# EAGLE design M-S (rev 01) (EAGLE 6.5.0)

## Sheet 1 of 3
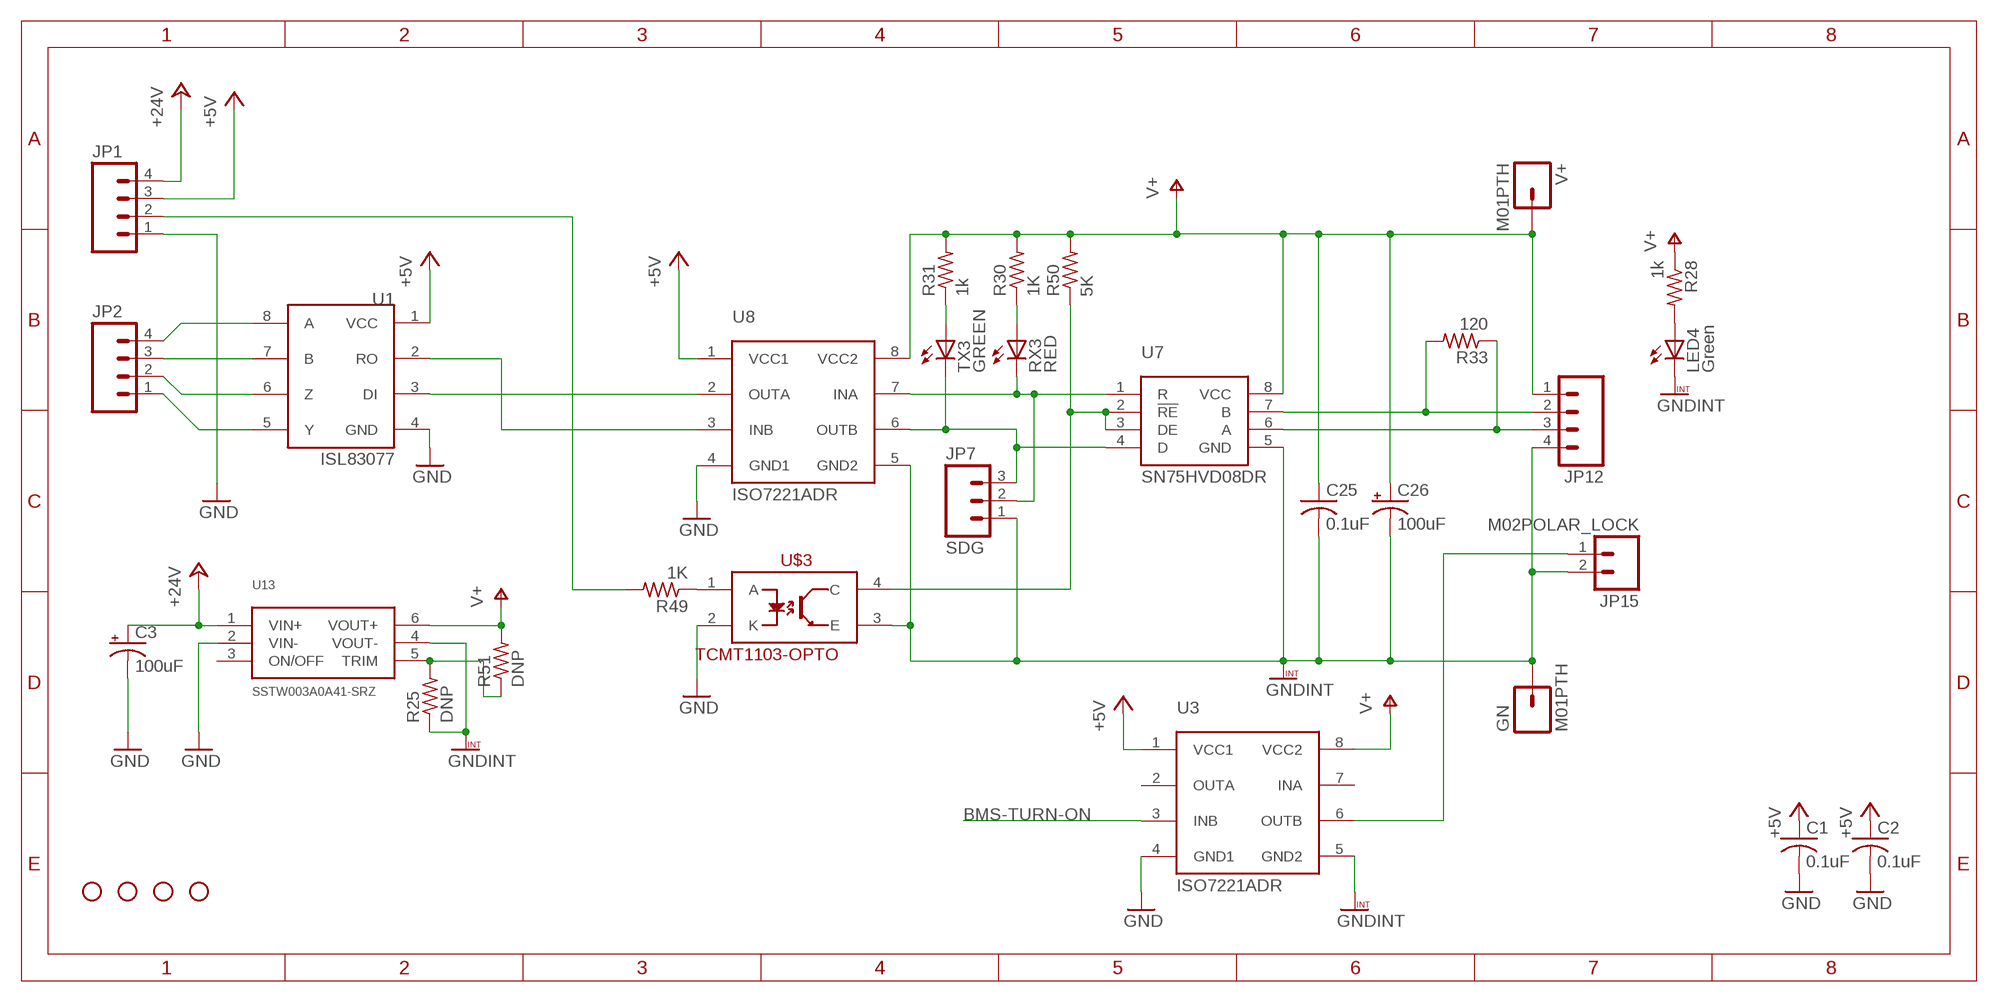
[diagram p0: schematic, sheet 1]

### Parts
C1  0.1uF  C-USC0805  [C0805]
C2  0.1uF  C-USC0805  [C0805]
C3  100uF  CPOL-USC/6032-28W  [C/6032-28W]
C25  0.1uF  C-USC0805  [C0805]
C26  100uF  CPOL-USC/6032-28W  [C/6032-28W]
GN  M01PTH  [1X01]
JP1  M04POLAR_LOCK  [MOLEX-1X4_LOCK]
JP2  M04POLAR_LOCK  [MOLEX-1X4_LOCK]
JP7  SDG  M03LOCK_LONGPADS  [1X03_LOCK_LONGPADS]
JP12  M04POLAR_LOCK  [MOLEX-1X4_LOCK]
JP15  M02POLAR_LOCK  [MOLEX-1X2_LOCK]
LED4  Green  LEDCHIPLED_0805  [CHIPLED_0805]
R25  DNP  R-US_R0805  [R0805]
R28  1k  R-US_R0805  [R0805]
R30  1K  R-US_R0805  [R0805]
R31  1k  R-US_R0805  [R0805]
R33  120  R-US_R0805  [R0805]
R49  1K  R-US_R0805  [R0805]
R50  5K  R-US_R0805  [R0805]
R51  DNP  R-US_R0805  [R0805]
RX3  RED  LEDCHIPLED_0805  [CHIPLED_0805]
STANDOFF1  STAND-OFF  [STAND-OFF]
STANDOFF2  STAND-OFF  [STAND-OFF]
STANDOFF3  STAND-OFF  [STAND-OFF]
STANDOFF4  STAND-OFF  [STAND-OFF]
TX3  GREEN  LEDCHIPLED_0805  [CHIPLED_0805]
U1  ISL83077  [SO08]
U3  ISO7221ADR  [SOIC-8]
U7  SN75HVD08DR  [SO-8]
U8  ISO7221ADR  [SOIC-8]
U13  SSTW003A0A41-SRZ  [SSTW003A0A41-SRZ]
U$3  TCMT1103-OPTO  [SSOP-4]
V+  M01PTH  [1X01]

### Nets
+5V: C1.1 C2.1 JP1.3 U1.1(VCC) U3.1(VCC1) U8.1(VCC1) ; also sheet 2
+24V: C3.+ JP1.4 U13.1(VIN+)
BMS-TURN-ON: U3.3(INB) ; also sheet 3
GND: C1.2 C2.2 C3.- JP1.1 U1.4(GND) U3.4(GND1) U8.4(GND1) U13.2(VIN-) U$3.2(K) ; also sheet 2,3
GNDINT: C25.2 C26.- GN.1 JP7.1 JP12.4 JP15.2 LED4.C R25.1 U3.5(GND2) U7.5(GND) U8.5(GND2) U13.4(VOUT-) U$3.3(E)
N$1: U1.3(DI) U8.2(OUTA)
N$2: U1.2(RO) U8.3(INB)
N$3: JP2.4 U1.8(A)
N$4: JP2.3 U1.7(B)
N$5: JP2.2 U1.6(Z)
N$6: JP2.1 U1.5(Y)
N$7: JP1.2 R49.2
N$21: JP15.1 U3.6(OUTB)
N$25: JP12.2 R33.2 U7.7(B)
N$31: JP12.3 R33.1 U7.6(A)
N$33: R25.2 R51.1 U13.5(TRIM)
N$50: LED4.A R28.2
N$56: R49.1 U$3.1(A)
N$59: R50.1 U7.2(!RE) U7.3(DE) U$3.4(C)
N$73: R30.1 RX3.A
N$74: R31.1 TX3.A
PIC1: JP7.2 RX3.C U7.1(R) U8.7(INA)
PIC2: JP7.3 TX3.C U7.4(D) U8.6(OUTB)
V+: C25.1 C26.+ JP12.1 R28.1 R30.2 R31.2 R50.2 R51.2 U3.8(VCC2) U7.8(VCC) U8.8(VCC2) U13.6(VOUT+) V+.1
Unconnected: U3.2(OUTA) U3.7(INA) U13.3(ON/OFF)

## Sheet 2 of 3
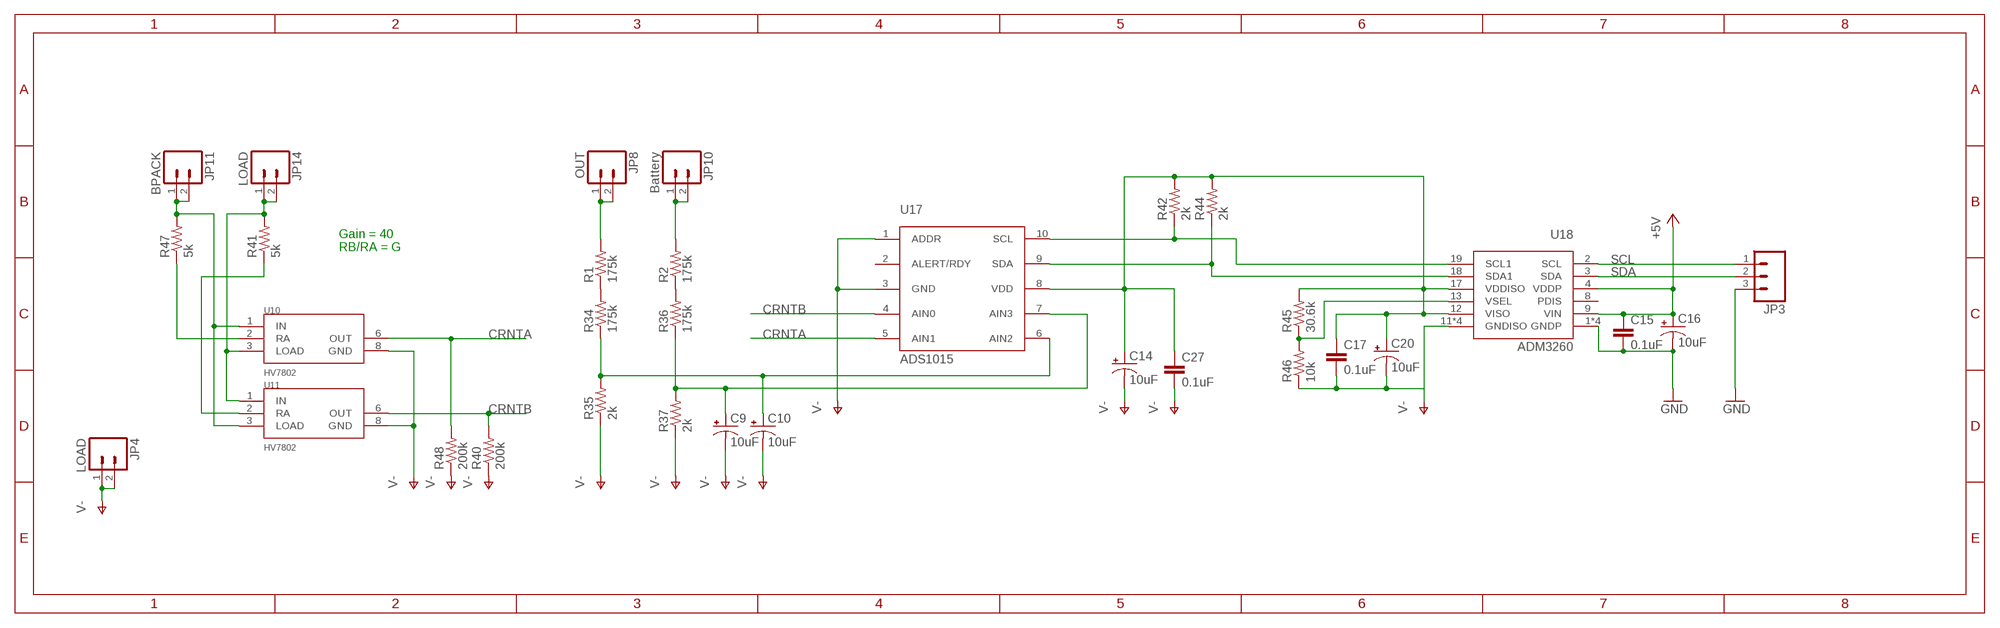
[diagram p1: schematic, sheet 2]

### Parts
C9  10uF  CAP_POL1206  [EIA3216]
C10  10uF  CAP_POL1206  [EIA3216]
C14  10uF  CAP_POL1206  [EIA3216]
C15  0.1uF  CAP0805  [0805]
C16  10uF  CAP_POL1206  [EIA3216]
C17  0.1uF  CAP0805  [0805]
C20  10uF  CAP_POL1206  [EIA3216]
C27  0.1uF  CAP0805  [0805]
JP3  M03POLAR_LOCK  [MOLEX-1X3_LOCK]
JP4  LOAD  M02POLAR_LOCK  [MOLEX-1X2_LOCK]
JP8  OUT  M02POLAR_LOCK  [MOLEX-1X2_LOCK]
JP10  Battery  M02POLAR_LOCK  [MOLEX-1X2_LOCK]
JP11  BPACK  M02POLAR_LOCK  [MOLEX-1X2_LOCK]
JP14  LOAD  M02POLAR_LOCK  [MOLEX-1X2_LOCK]
R1  175k  RESISTOR1206  [1206]
R2  175k  RESISTOR1206  [1206]
R34  175k  RESISTOR1206  [1206]
R35  2k  RESISTOR1206  [1206]
R36  175k  RESISTOR1206  [1206]
R37  2k  RESISTOR1206  [1206]
R40  200k  RESISTOR0805-RES  [0805]
R41  5k  RESISTOR0805-RES  [0805]
R42  2k  RESISTOR0805-RES  [0805]
R44  2k  RESISTOR0805-RES  [0805]
R45  30.6k  RESISTOR0805-RES  [0805]
R46  10k  RESISTOR0805-RES  [0805]
R47  5k  RESISTOR0805-RES  [0805]
R48  200k  RESISTOR0805-RES  [0805]
U10  HV7802  [MSOP-8]
U11  HV7802  [MSOP-8]
U17  ADS1015  [MSOP-10]
U18  ADM3260  [SSOP-20]

### Nets
+5V: C15.1 C16.A(+) U18.4(VDDP) U18.9(VIN) ; also sheet 1
CRNTA: R48.2 U10.6(OUT) U17.5(AIN1)
CRNTB: R40.2 U11.6(OUT) U17.4(AIN0)
GND: C15.2 C16.C(-) JP3.3 U18.1(GNDP) U18.5(GNDP) U18.7(GNDP) U18.10(GNDP) ; also sheet 1,3
N$8: R41.1 U11.2(RA)
N$9: R47.1 U10.2(RA)
N$10: R1.1 R34.2
N$11: JP14.1 JP14.2 R41.2 U10.3(LOAD) U11.1(IN)
N$12: R2.1 R36.2
N$35: JP8.1 JP8.2 R1.2
N$42: JP11.1 JP11.2 R47.2 U10.1(IN) U11.3(LOAD)
N$43: C10.A(+) R34.1 R35.2 U17.6(AIN2)
N$52: JP10.1 JP10.2 R2.2
N$53: C9.A(+) R36.1 R37.2 U17.7(AIN3)
N$57: C14.A(+) C17.1 C20.A(+) C27.1 R42.2 R44.2 R45.2 U17.8(VDD) U18.12(VISO) U18.17(VDDISO)
N$60: R42.1 U17.10(SCL) U18.19(SCL1)
N$67: R44.1 U17.9(SDA) U18.18(SDA1)
N$68: R45.1 R46.2 U18.13(VSEL)
SCL: JP3.1 U18.2(SCL)
SDA: JP3.2 U18.3(SDA)
V-: C9.C(-) C10.C(-) C14.C(-) C17.2 C20.C(-) C27.2 JP4.1 JP4.2 R35.1 R37.1 R40.1 R46.1 R48.1 U10.8(GND) U11.8(GND) U17.1(ADDR) U17.3(GND) U18.11(GNDISO) U18.14(GNDISO) U18.16(GNDISO) U18.20(GNDISO) ; also sheet 3
Unconnected: U17.2(ALERT/RDY) U18.8(PDIS)

### Notes on the sheet
- Gain = 40
  RB/RA = G

## Sheet 3 of 3
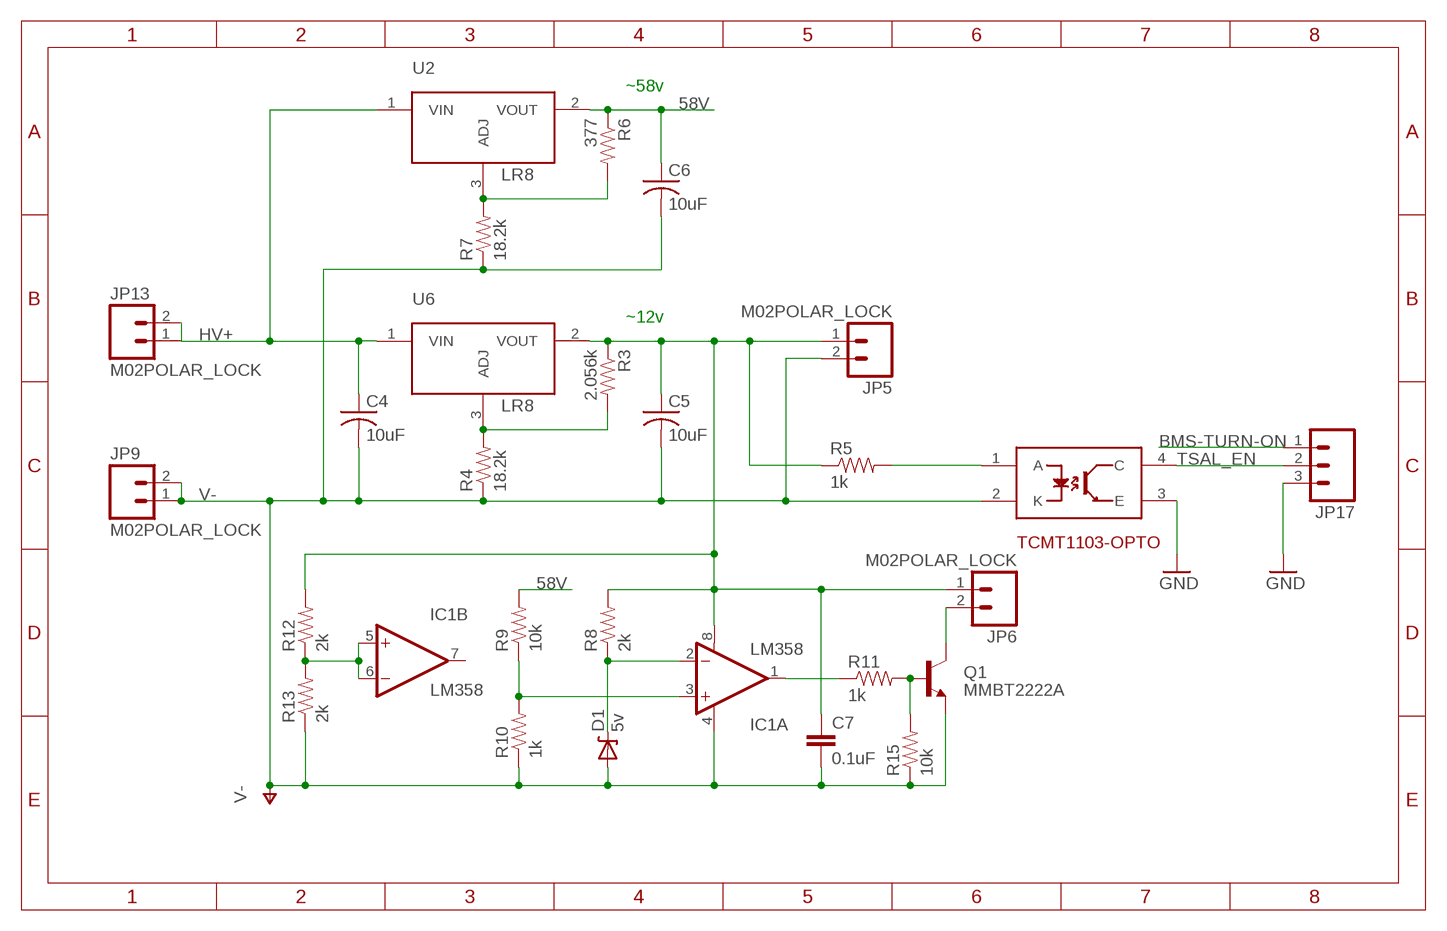
[diagram p2: schematic, sheet 3]

### Parts
C4  10uF  C-US050-030X075  [C050-030X075]
C5  10uF  C-USC0805  [C0805]
C6  10uF  C-USC0805  [C0805]
C7  0.1uF  CAP0805  [0805]
D1  5v  DIODE-ZENER-BZT52  [SOD-323@1]
IC1  LM358  OPAMP-DUALU  [SO08]
JP5  M02POLAR_LOCK  [MOLEX-1X2_LOCK]
JP6  M02POLAR_LOCK  [MOLEX-1X2_LOCK]
JP9  M02POLAR_LOCK  [MOLEX-1X2_LOCK]
JP13  M02POLAR_LOCK  [MOLEX-1X2_LOCK]
JP17  M03POLAR_LOCK  [MOLEX-1X3_LOCK]
Q1  MMBT2222A  TRANSISTOR_NPNMMBT2222A  [SOT23]
R3  2.056k  RESISTOR0805-RES  [0805]
R4  18.2k  RESISTOR0805-RES  [0805]
R5  1k  RESISTOR0805-RES  [0805]
R6  377  RESISTOR0805-RES  [0805]
R7  18.2k  RESISTOR0805-RES  [0805]
R8  2k  RESISTOR0805-RES  [0805]
R9  10k  RESISTOR0805-RES  [0805]
R10  1k  RESISTOR0805-RES  [0805]
R11  1k  RESISTOR0805-RES  [0805]
R12  2k  RESISTOR0805-RES  [0805]
R13  2k  RESISTOR0805-RES  [0805]
R15  10k  RESISTOR0805-RES  [0805]
U2  LR8  [DPAK]
U6  LR8  [DPAK]
U$11  TCMT1103-OPTO  [SSOP-4]

### Nets
58V: C6.1 R6.1 R9.2 U2.2(VOUT)
BMS-TURN-ON: JP17.1 ; also sheet 1
GND: JP17.3 U$11.3(E) ; also sheet 1,2
HV+: C4.1 JP13.1 JP13.2 U2.1(VIN) U6.1(VIN)
N$13: R6.2 R7.2 U2.3(ADJ)
N$14: D1.1(C) IC1.2(A:-IN) R8.1
N$15: IC1.3(A:+IN) R9.1 R10.2
N$16: R5.2 U$11.1(A)
N$17: IC1.1(A:OUT) R11.1
N$18: Q1.1(B) R11.2 R15.2
N$19: JP6.2 Q1.3(C)
N$20: IC1.5(B:+IN) IC1.6(B:-IN) R12.1 R13.2
N$38: C5.1 C7.1 IC1.8(A:V+) JP5.1 JP6.1 R3.1 R5.1 R8.2 R12.2 U6.2(VOUT)
N$39: R3.2 R4.2 U6.3(ADJ)
TSAL_EN: JP17.2 U$11.4(C)
V-: C4.2 C5.2 C6.2 C7.2 D1.2(A) IC1.4(A:V-) JP5.2 JP9.1 JP9.2 Q1.2(E) R4.1 R7.1 R10.1 R13.1 R15.1 U$11.2(K) ; also sheet 2
Unconnected: IC1.7(B:OUT)

### Notes on the sheet
- ~58v
- ~12v

## Library data of the parts
C1 C2 C4-C6 C25 = rcl:C-US: CAPACITOR, American symbol
C3 C26 = rcl:CPOL-US: POLARIZED CAPACITOR, American symbol
C7 = SparkFun-Passives:CAP: Capacitor Standard 0603 ceramic capacitor, and 0.1" leaded capacitor.
C9 C10 C14 C16 C20 = SparkFun-Capacitors:CAP_POL: Capacitor Polarized These are standard SMD and PTH capacitors. Normally 10uF, 47uF, and 100uF in electrolytic and tantalum varieties. Always verify the external diameter of the through hole cap, it varies with capacity, voltage, and manufacturer. The EIA devices should be standard.
C15 C17 C27 = SparkFun-Capacitors:CAP: Capacitor Standard 0603 ceramic capacitor, and 0.1" leaded capacitor.
D1 = SparkFun-DiscreteSemi:DIODE-ZENER: Zener Diode Production Part - 8199 3.4V Zener Voltage
GN V+ = SparkFun-Connectors:M01: Header 1 Standard 1-pin 0.1" header. Use with straight break away headers (SKU : PRT-00116), right angle break away headers (PRT-00553), swiss pins (PRT-00743), machine pins (PRT-00117), and female headers (PRT-00115).
IC1 = SparkFun-AnalogIC:OPAMP-DUAL: Generic op-amp footprint
JP1 JP2 JP12 = SparkFun-Connectors:M04: Header 4 Standard 4-pin 0.1" header. Use with straight break away headers (SKU : PRT-00116), right angle break away headers (PRT-00553), swiss pins (PRT-00743), machine pins (PRT-00117), and female headers (PRT-00115). Molex polarized connector foot print use with SKU : PRT-08231 with associated crimp pins and housings. 1MM SMD Version SKU: PRT-10208
JP3 JP7 JP17 = SparkFun-Connectors:M03: Header 3 Standard 3-pin 0.1" header. Use with straight break away headers (SKU : PRT-00116), right angle break away headers (PRT-00553), swiss pins (PRT-00743), machine pins (PRT-00117), and female headers (PRT-00115). Molex polarized connector foot print use with SKU : PRT-08232 with associated crimp pins and housings.
JP4-JP6 JP8-JP11 JP13-JP15 = SparkFun-Connectors:M02: Standard 2-pin 0.1" header. Use with - straight break away headers ( PRT-00116) - right angle break away headers (PRT-00553) - swiss pins (PRT-00743) - machine pins (PRT-00117) - female headers (PRT-00115) Molex polarized connector foot print use with: PRT-08233 with associated crimp pins and housings. 2.54_SCREWTERM for use with PRT-10571. 3.5mm Screw Terminal footprints for PRT-08084 5mm Screw Terminal footprints for use with PRT-08432
LED4 RX3 TX3 = adafruit:LED: LED OSRAM: - CHIPLED LG R971, LG N971, LY N971, LG Q971, LY Q971, LO R971, LY R971 LH N974, LH R974 LS Q976, LO Q976, LY Q976 LO Q996 - Hyper CHIPLED LW Q18S LB Q993, LB Q99A, LB R99A - SideLED LS A670, LO A670, LY A670, LG A670, LP A670 LB A673, LV A673, LT A673, LW A673 LH A674 LY A675 LS A676, LA A676, LO A676, LY A676, LW A676 LS A679, LY A679, LG A679 - Hyper Micro SIDELED® LS Y876, LA Y876, LO Y876, LY Y876 LT Y87S - SmartLED LW L88C, LW L88S LB L89C, LB L89S, LG L890 LS L89K, LO L89K, LY L89K LS L896, LA L896, LO L896, LY L896 - TOPLED LS T670, LO T670, LY T670, LG T670, LP T670 LSG T670, LSP T670, LSY T670, LOP T670, LYG T670 LG T671, LOG T671, LSG T671 LB T673, LV T673, LT T673, LW T673 LH T674 LS T676, LA T676, LO T676, LY T676, LB T676, LH T676, LSB T676, LW T676 LB T67C, LV T67C, LT T67C, LS T67K, LO T67K, LY T67K, LW E67C LS E67B, LA E67B, LO E67B, LY E67B, LB E67C, LV E67C, LT E67C LW T67C LS T679, LY T679, LG T679 LS T770, LO T770, LY T770, LG T770, LP T770 LB T773, LV T773, LT T773, LW T773 LH T774 LS E675, LA E675, LY E675, LS T675 LS T776, LA T776, LO T776, LY T776, LB T776 LHGB T686 LT T68C, LB T68C - Hyper Mini TOPLED® LB M676 - Mini TOPLED Santana® LG M470 LS M47K, LO M47K, LY M47K Source: http://www.osram.convergy.de/
Q1 = SparkFun-DiscreteSemi:TRANSISTOR_NPN: Generic NPN BJT MMBT2222A - TRANS-08049 (SOT-23, 1A 40V) MPSA42 - TRANS-09116 (SOT-23, 500mA 300V) MMBT5088LT1G - TRANS-11160 (SOT-23, 50 mA 30V); PROD_ID: TRANS-08049
R1-R13 R15 R34-R37 R40-R42 R44-R48 = SparkFun-Passives:RESISTOR: Resistor Basic schematic elements and footprints for 0603, 1206, and PTH resistors.
R25 R28 R30 R31 R33 R49-R51 = adafruit:R-US_: RESISTOR, American symbol
STANDOFF1-STANDOFF4 = SparkFun-Electromechanical:STAND-OFF: #4 Stand Off This is the mechanical footprint for a #4 phillips button head screw. Use the keepout ring to avoid running the screw head into surrounding components. SKU : PRT-00447
U1 = NASA_LIB:ISL83077
U2 U6 = FSAE Eletric:LR8
U3 U8 = Gasbarre:ISO7221ADR
U7 = FSAE Eletric:SN75HVD08DR
U10 U11 = FSAE Eletric:HV7802
U13 = FSAE Eletric:SSTW003A0A41-SRZ
U17 = NASA_LIB:ADS1015
U18 = FSAE Eletric:ADM3260
U$3 U$11 = SparkFun-DiscreteSemi:TCMT1103-OPTO: Optoisolator- NPN output

## Board
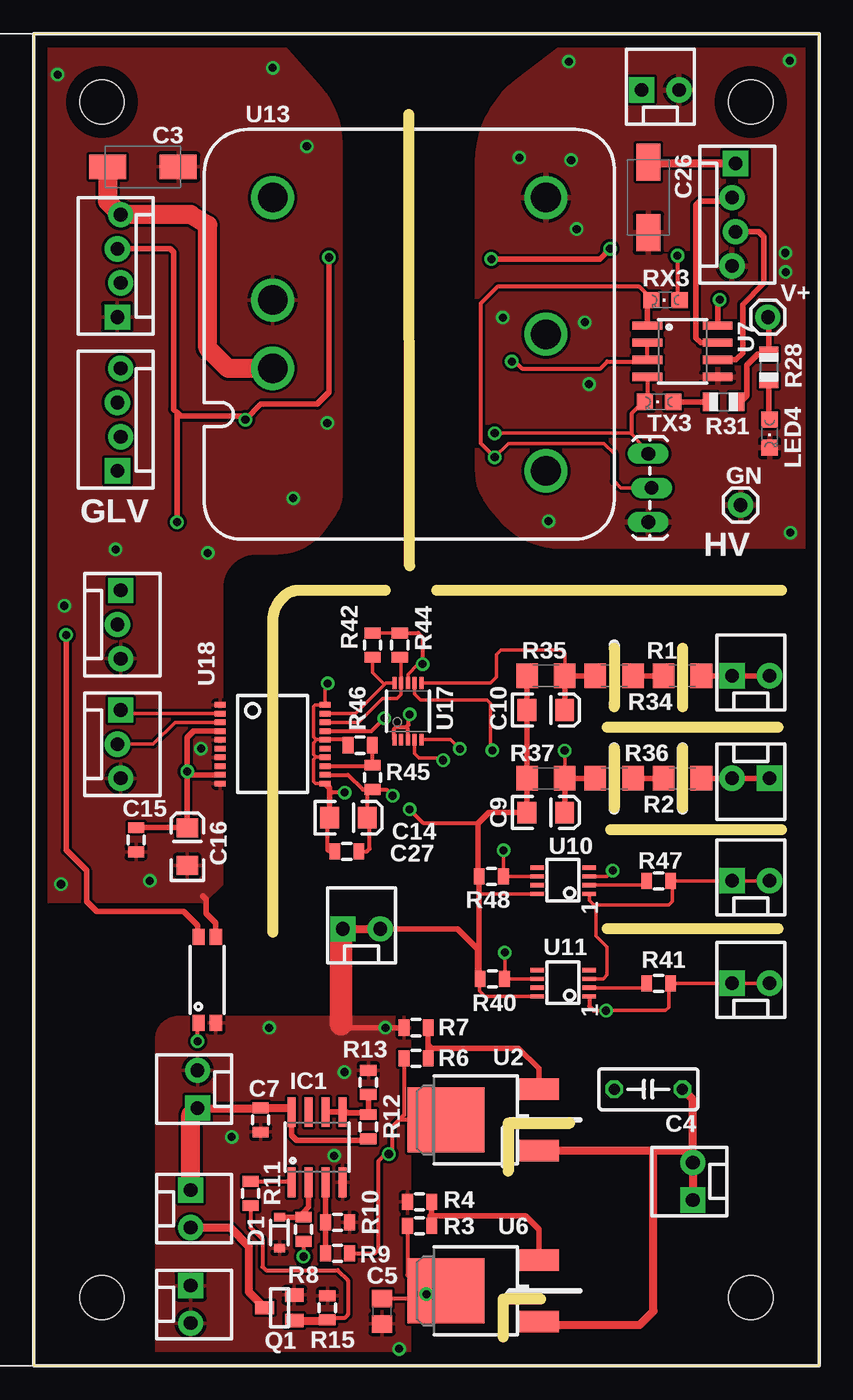
[diagram p3: board, top side]
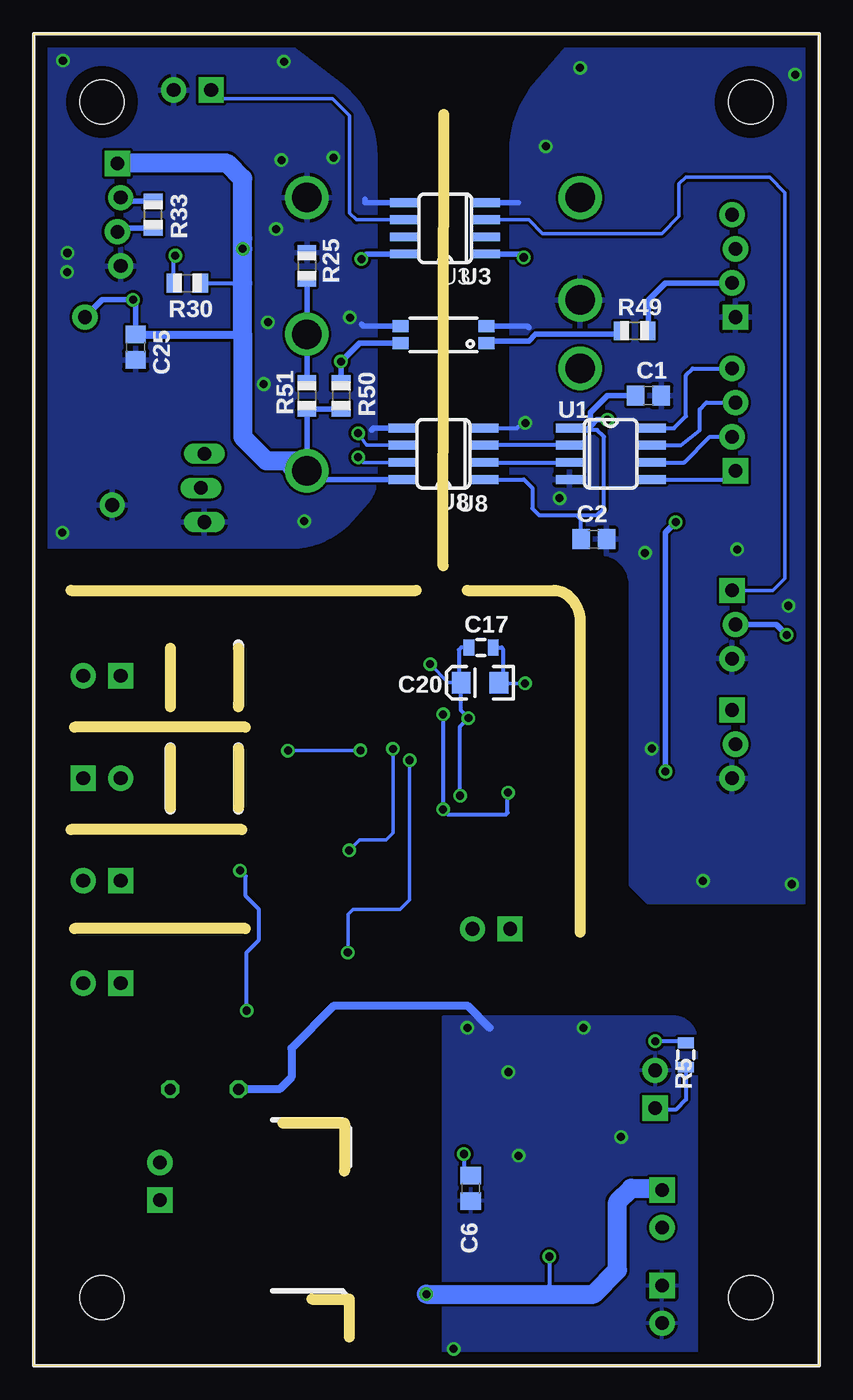
[diagram p4: board, bottom side, seen from below]

Size 58.42 x 99.06 mm. Coordinates in mm from the lower left corner, seen from the top.
Outline: 55.63,57.66 29.97,57.66
Outline: 27.96,59.49 27.91,93.04
Outline: 26.16,57.66 19.72,57.66 arc45 18.58,57.19 18.47,57.07 arc45 17.78,55.42 17.78,32.26
Outline: 42.67,47.5 55.37,47.5
Outline: 42.93,39.88 55.63,39.88
Outline: 42.67,32.51 55.37,32.51
Outline: 48.26,53.37 48.26,49.02
Outline: 34.92,2.16 34.92,4.95 37.72,4.95
Outline: 43.18,53.37 43.18,49.02
Outline: 48.26,45.87 48.26,41.53
Outline: 43.18,45.87 43.18,41.53
Outline: 35.31,18.03 35.31,14.48
Outline: 35.69,18.03 39.88,18.03
Outline: 0,0 58.42,0 58.42,99.06 0,99.06 0,0
Copper layers (1*16): Top 0.035mm / dielectric 1.5mm / Bottom 0.035mm
Design rules "default": minimum track width 10mil, minimum drill 24mil, track to track 8mil, track to pad 8mil, pad to pad 8mil, via to via 8mil, smd to smd 8mil, copper to edge 40mil, drill to drill 8mil, minimum pad ring 10mil, minimum via ring 8mil, stop-mask expansion 4mil, vias tented up to drill 0mil, thermal gap 10mil

### Footprints (pad centres in the part's own frame; a part is rotated, then mirrored left to right if it is on the bottom)
C0805 = smd 1.3 x 1.5: 1 -0.95,0; 2 0.95,0
C/6032-28W = smd 2.75 x 1.8: + 2.625,0; - -2.625,0
C050-030X075 = drill 0.813 octagon: 1 -2.54,0; 2 2.54,0
0805 = smd 0.8 x 1.2: 1 -0.9,0; 2 0.9,0
EIA3216 = smd 1.4 x 1.6: A 1.4,0; C -1.4,0
SOD-323@1 = smd 0.63 x 0.83: 1 -1.15,0; 2 1.15,0
1X01 = drill 1.016 pad 1.88: 1 0,0
SO08 = smd 0.61 x 2.21: 1 -1.905,-2.616; 2 -0.635,-2.616; 3 0.635,-2.616; 4 1.905,-2.616; 5 1.905,2.616; 6 0.635,2.616; 7 -0.635,2.616; 8 -1.905,2.616
MOLEX-1X4_LOCK = drill 1.016 pad 1.88 square: 1 0,0.127 | drill 1.016 pad 1.88: 2 2.54,-0.127; 3 5.08,0.127; 4 7.62,-0.127
MOLEX-1X3_LOCK = drill 1.016 pad 1.88 square: 1 0,0.127 | drill 1.016 pad 1.88: 2 2.54,-0.127; 3 5.08,0.127
MOLEX-1X2_LOCK = drill 1.016 pad 1.88 square: 1 -0.127,0 | drill 1.016 pad 1.88: 2 2.667,0
1X03_LOCK_LONGPADS = drill 1.016 long: 1 0,0; 2 2.54,-0.254; 3 5.08,0
CHIPLED_0805 = smd 1.2 x 1.2: A 0,-1.05; C 0,1.05
SOT23 = smd 1 x 1.4: 1 -0.95,-1.1; 2 0.95,-1.1; 3 0,1.1
1206 = smd 1.6 x 1.8: 1 -1.4,0; 2 1.4,0
R0805 = smd 1.1 x 1.4: 1 -1,0; 2 1,0
STAND-OFF = hole 3.302: 0,0
SO08' = smd 0.66 x 2.032: 1 -1.905,-3.073; 2 -0.635,-3.073; 3 0.635,-3.073; 4 1.905,-3.073; 5 1.905,3.073; 6 0.635,3.073; 7 -0.635,3.073; 8 -1.905,3.073
DPAK = smd 1.6 x 3: 1 -2.28,-4.04; 3 2.28,-4.04 | smd 4.826 x 5.715: 2 0,2.858
SOIC-8 = smd 0.66 x 2.032: 1 -1.905,-3.073; 2 -0.635,-3.073; 3 0.635,-3.073; 4 1.905,-3.073; 5 1.905,3.073; 6 0.635,3.073; 7 -0.635,3.073; 8 -1.905,3.073
SO-8 = smd 0.61 x 2.21: 1 -1.905,-2.616; 2 -0.635,-2.616; 3 0.635,-2.616; 4 1.905,-2.616; 5 1.905,2.616; 6 0.635,2.616; 7 -0.635,2.616; 8 -1.905,2.616
MSOP-8 = smd 0.3 x 1: 1 -0.975,-1.95; 2 -0.325,-1.95; 3 0.325,-1.95; 4 0.975,-1.95; 5 0.975,1.925; 6 0.325,1.925; 7 -0.325,1.925; 8 -0.975,1.925
SSTW003A0A41-SRZ = drill 2.2: 1 -10.16,-2.54; 2 -10.16,2.54; 3 -10.16,10.16; 4 10.16,10.16; 5 10.16,0; 6 10.16,-10.16
MSOP-10 = smd 0.305 x 0.889: 1 -1,-2.11; 2 -0.5,-2.11; 3 0,-2.11; 4 0.5,-2.11; 5 1,-2.11; 6 1,2.11; 7 0.5,2.11; 8 0,2.11; 9 -0.5,2.11; 10 -1,2.11
SSOP-20 = smd 0.813 x 0.406: 1 -3.9,2.925; 2 -3.9,2.275; 3 -3.9,1.625; 4 -3.9,0.975; 5 -3.9,0.325; 6 -3.9,-0.325; 7 -3.9,-0.975; 8 -3.9,-1.625; 9 -3.9,-2.275; 10 -3.9,-2.925; 11 3.9,-2.925; 12 3.9,-2.275; 13 3.9,-1.625; 14 3.9,-0.975; 15 3.9,-0.325; 16 3.9,0.325; 17 3.9,0.975; 18 3.9,1.625; 19 3.9,2.275; 20 3.9,2.925
SSOP-4 = smd 1.2 x 0.9: 1 -3.2,0.67; 2 -3.2,-0.6; 3 3.2,-0.6; 4 3.2,0.67

### Placement (x,y rotation side)
C1  12.7,72.14 0 bottom
C2  16.76,61.47 0 bottom
C3  8.13,89.15 180 top
C4  45.72,20.57 180 top
C5  25.91,4.06 270 top
C6  25.91,13.21 270 bottom
C7  16.89,18.29 270 top
C9  38.1,41.15 0 top
C10  38.1,48.77 0 top
C14  23.42,40.77 0 top
C15  7.62,39.12 270 top
C16  11.43,38.61 90 top
C17  25.15,53.42 0 bottom
C20  25.22,50.8 180 bottom
C25  50.83,75.74 270 bottom
C26  45.72,86.87 90 top
C27  23.29,38.25 180 top
D1  18.29,9.91 270 top
GN  52.58,64.01 0 top
IC1  21.08,16.26 0 top
JP1  6.35,77.98 90 top
JP2  6.35,66.55 90 top
JP3  6.35,48.77 270 top
JP4  23.11,32.49 0 top
JP5  12.19,19.3 90 top
JP6  11.68,12.95 270 top
JP7  45.72,62.74 90 top
JP8  52.07,51.31 0 top
JP9  11.68,5.84 270 top
JP10  54.61,43.69 180 top
JP11  52.07,36.07 0 top
JP12  52.07,89.41 270 top
JP13  49.02,12.45 90 top
JP14  52.07,28.45 0 top
JP15  45.34,94.87 0 top
JP17  6.35,57.66 270 top
LED4  54.74,69.32 180 top
Q1  18.29,4.32 90 top
R1  48.26,51.31 0 top
R2  48.26,43.69 0 top
R3  28.7,10.41 0 top
R4  28.7,12.19 0 top
R5  9.91,23.11 90 bottom
R6  28.45,22.86 0 top
R7  28.45,25.15 0 top
R8  20.07,10.16 270 top
R9  22.61,8.38 0 top
R10  22.61,10.67 180 top
R11  16.13,12.83 270 top
R12  24.89,17.78 270 top
R13  24.89,21.08 270 top
R15  21.84,4.32 270 top
R25  38.1,81.79 270 bottom
R28  54.69,74.24 270 top
R30  46.99,80.52 0 bottom
R31  51.31,71.68 0 top
R33  49.53,85.6 90 bottom
R34  43.18,51.31 0 top
R35  38.1,51.31 0 top
R36  43.18,43.69 0 top
R37  38.1,43.69 0 top
R40  34.11,28.78 0 top
R41  46.48,28.45 0 top
R42  25.2,53.59 90 top
R44  27.23,53.59 90 top
R45  25.2,43.76 270 top
R46  24.28,46.15 0 top
R47  46.48,36.07 0 top
R48  34.04,36.4 0 top
R49  13.72,76.96 0 bottom
R50  35.56,72.14 270 bottom
R51  38.1,72.14 270 bottom
RX3  46.99,79.25 90 top
STANDOFF1  5.08,5.08 0 top
STANDOFF2  53.34,5.08 0 top
STANDOFF3  5.08,93.98 0 top
STANDOFF4  53.34,93.98 0 top
TX3  46.51,71.68 90 top
U1  ISL83077  [SO08']  15.49,67.82 270 bottom
U2  33.53,18.29 90 top
U3  27.81,84.58 90 bottom
U6  33.53,5.59 90 top
U7  48.26,75.44 270 top
U8  27.94,67.82 90 bottom
U10  39.37,36.07 90 top
U11  39.37,28.45 90 top
U13  27.94,76.71 0 top
U17  27.84,48.67 0 top
U18  17.78,46.23 0 top
U$3  27.94,76.71 180 bottom
U$11  12.95,28.7 90 top
V+  54.61,77.98 270 top

### Tracks (layer width: path | path; a pad name or v marks a point on that pad's centre or on a via)
58V  (via drill 0.6)
  Top 0.305: R9.2 25.4,8.38 25.65,8.64 25.65,15.24 26.16,15.75 v26.42,15.75 26.67,16 26.67,17.78 27.18,18.29 | U2.2 27.18,18.29 | R6.1 27.55,18.66 27.18,18.29
  Bottom 0.305: v26.42,15.75 26.42,14.67 C6.1
+5V  (via drill 0.6)
  Top 0.406: C15.1 C16.A 11.43,43.94 | 11.43,43.94 U18.9 | 11.43,43.94 v11.43,44.2 11.43,46.74 11.9,47.2 U18.4 | JP1.3 10.16,83.06 10.41,82.8 10.41,71.12 10.67,70.87 | 10.67,70.87 10.92,70.61 15.49,70.61 v15.75,70.36 16.89,71.5 21.08,71.5 21.97,72.39 v21.97,82.42 | v10.67,62.74 10.67,70.87
  Bottom 0.305: U8.1 21.97,65.91 21.34,65.28 21.34,63.75 20.83,63.25 18.03,63.25 | 18.03,63.25 16.51,63.25 16,63.75 16,69.09 16.51,69.6 17.27,69.6 | C2.1 17.71,62.93 18.03,63.25
  Bottom 0.406: C1.1 15.75,72.14 17.02,70.87 17.02,69.85 | 17.02,69.85 17.27,69.6 18.44,69.6 U1.1 | v15.75,70.36 16.51,70.36 17.02,69.85 | v11.43,44.2 11.43,61.98 v10.67,62.74 | U3.1 22.23,82.68 v21.97,82.42
+24V
  Top 1.422: U13.1 14.48,74.17 12.95,75.69 12.95,84.84 11.68,85.6 JP1.4 5.5,86.57 C3.+
BMS-TURN-ON
  Bottom 0.254: U3.3 21.59,85.22 20.57,84.2 11.68,84.2 10.41,85.47 10.41,87.88 9.91,88.39 3.68,88.39 2.54,87.25 2.54,58.55 3.43,57.66 JP17.1
CRNTA  (via drill 0.6)
  Top 0.254: U17.5 31.02,46.56 v31.7,45.87 | v34.95,38.33 34.95,36.41 R48.2 U10.6
  Bottom 0.254: v31.7,45.87 31.7,39.62 32.21,39.12 34.16,39.12 v34.95,38.33
CRNTB  (via drill 0.6)
  Top 0.254: U17.4 28.34,45.55 28.68,45.21 30.28,45.21 v30.45,45.03 | v35.05,30.73 35.05,28.82 R40.2 U11.6
  Bottom 0.254: v30.45,45.03 30.45,34.65 31.17,33.93 34.67,33.93 35.03,33.58 35.03,30.76 v35.05,30.73
GND  (via drill 0.6)
  Top 0.406: U$11.3 13.55,32.93 12.83,33.66 12.83,34.67 12.57,34.92
  Bottom 0.305: U8.4 22.48,69.72 22.1,70.1
  Bottom 0.406: U$3.2 21.68,77.31 21.59,77.22 | U3.4 22.35,86.49
  other vias: 1.78,96.01 17.78,96.52 20.32,90.68 12.95,60.45 2.03,35.81 8.64,36.07 6.1,60.71 19.3,64.52 21.84,70.1 12.45,45.9 2.29,56.52
  pour Top: 0,34.54 0,99.06 17.78,99.06 21.32,94.99 arc-41 22.86,90.87 22.86,64.91 arc-36 22.34,63.27 21.59,62.23 arc-54 18.14,60.45 16.61,60.45 arc90 13.97,57.81 13.97,35.81 12.7,34.54
  pour Bottom: 0,99.06 17.78,99.06 20.85,95.53 arc-41 22.86,90.16 22.86,64.89 arc-36 22.35,63.29 21.64,62.3 arc-54 18.05,60.45 16.33,60.45 arc90 13.97,58.09 13.97,35.81 12.7,34.54 0,34.54
GNDINT  (via drill 0.6)
  Bottom 0.406: U8.5 33.15,69.72 33.27,69.6 | U$3.3 33.87,77.31 34.04,77.47 | U3.5 33.78,86.49 33.78,86.74
  other vias: 41,77.6 40.39,84.53 41.3,73 34.9,77.95 55.93,81.33 55.91,82.75 36.12,89.84 39.98,89.66 56.24,97.05 39.8,96.98 38.3,62.81 56.29,61.95
  pour Top: 40.64,99.06 35.96,95.48 arc53 33.02,89.51 33.02,66.66 arc41 34.1,63.79 34.87,62.9 arc48 39.16,60.93 58.42,60.96 58.42,99.06
  pour Bottom: 40.64,99.06 35.61,95.21 arc53 33.02,89.95 33.02,66.07 arc41 33.71,64.23 34.85,62.93 arc48 39.19,60.93 58.42,60.96 58.42,99.06
HV+
  Top 0.61: 49.02,16 JP13.2 JP13.1 | 49.02,16 49.02,19.81 C4.1 | 49.02,16 46.23,16 | 46.23,16 U2.1 | 37.83,3.05 45.09,3.05 46.1,4.06 46.1,15.88 46.23,16
  Top 1.016: 37.83,3.05 U6.1
N$1
  Bottom 0.305: U8.2 U1.3
N$2
  Bottom 0.305: U1.2 U8.3
N$3
  Bottom 0.305: U1.8 10.79,69.72 9.91,70.61 9.91,73.66 9.4,74.17 JP2.4
N$4
  Bottom 0.305: U1.7 10.29,68.45 8.89,69.6 8.89,71.12 8.38,71.63 JP2.3
N$5
  Bottom 0.305: U1.6 10.03,67.18 8.13,69.09 JP2.2
N$6
  Bottom 0.305: U1.5 6.86,65.91 JP2.1
N$7
  Bottom 0.406: JP1.2 11.43,80.52 12.7,79.25 12.7,76.98 R49.2
N$8
  Top 0.254: U11.2 45.51,28.12 R41.1
N$9
  Top 0.254: U10.2 45.58,35.74 R47.1
N$10
  Top 0.406: R34.2 R1.1
N$11  (via drill 0.6)
  Top 0.254: v42.57,26.42 46.99,26.42 47.24,26.67 47.24,28.06 R41.2 JP14.1 JP14.2 | 41.19,36.4 U10.3 42.62,36.4 43.05,36.83 v43.08,36.83
  Top 0.305: U11.1 41.32,26.75 41.66,26.42 v42.57,26.42
  Bottom 0.305: v42.57,26.42 42.57,30.76 41.66,31.67 41.66,33.93 42.65,34.92 42.65,36.4 v43.08,36.83
N$12
  Top 0.406: R36.2 R2.1
N$13
  Top 0.406: R6.2 29.35,23.88 | 29.35,23.88 R7.2 | U2.3 37.57,22.12 36.07,23.62 29.6,23.62 29.35,23.88
N$14
  Top 0.406: IC1.2 20.45,11.81 20.07,11.43 R8.1 18.55,11.06 D1.1
N$15
  Top 0.406: IC1.3 R10.2 R9.1
N$16  (via drill 0.6)
  Top 0.305: v12.19,24.13 12.19,25.41 U$11.1
  Bottom 0.305: R5.2 9.54,24.01 10.41,24.13 v12.19,24.13
N$17
  Top 0.305: R11.1 18.88,13.73 IC1.1
N$18
  Top 0.305: R11.2 16.13,10.29 17.02,9.4 17.02,7.37 17.27,7.11 22.61,7.11 23.37,6.35 23.37,3.81 23.11,3.56 21.98,3.56 R15.2
  Top 0.61: Q1.1 21.79,3.37 R15.2
N$19
  Top 0.61: JP6.2 14.61,10.29 16,8.89 16,5.5 Q1.3
N$20
  Top 0.406: IC1.6 IC1.5 23.29,18.87 23.37,18.8 24.52,18.8 R12.1 R13.2
N$21
  Bottom 0.254: U3.6 34.42,85.22 34.92,85.72 34.92,92.96 36.2,94.23 44.58,94.23 JP15.1
N$25
  Top 0.406: U7.7 49.61,76.07 49.25,76.43 49.25,86.32 R33.2 51.67,86.6 JP12.2
  Bottom 0.406: R33.2 51.67,86.6 JP12.2
N$31
  Top 0.406: U7.6 52.22,74.8 52.73,75.31 52.73,78.92 54.3,80.49 54.3,83.97 53.95,84.33 JP12.3
  Bottom 0.406: R33.1 51.93,84.6 JP12.3
N$33
  Bottom 0.406: R51.1 U13.5 R25.2
N$35
  Top 0.406: JP8.2 JP8.1 R1.2
N$38  (via drill 0.6)
  Top 0.305: 12.23,19.14 JP5.1 | R3.1 27.8,6.74 v29.21,5.33 28.89,5.01 C5.1 | R8.2 v20.07,8.13
  Top 0.406: 18.91,19.14 IC1.8 19.18,17.14 19.56,16.76 24.52,16.76 R12.2
  Top 0.61: 12.23,19.14 16.89,19.14 C7.1 19.18,19.19 IC1.8
  Top 1.422: JP6.1 11.68,18.67 JP5.1 | U6.2 29.46,5.59 v29.21,5.33
  Bottom 0.305: R5.1 9.91,19.81 10.67,19.05 12.06,19.05 JP5.1 | v20.07,8.13 20.07,5.33
  Bottom 1.422: v29.21,5.33 20.07,5.33 16.76,5.33 14.99,7.11 14.99,12.19 13.97,13.21 11.81,13.21 JP6.1
N$39
  Top 0.406: R3.2 R4.2 29.6,10.53 29.72,10.41 29.72,10.92 29.46,11.18 36.58,11.18 37.59,10.16 37.59,7.89 U6.3
N$42
  Top 0.254: U10.1 41.32,34.63 41.66,34.29 41.81,34.29 | 41.81,34.29 47.24,34.29 47.5,34.54 47.5,35.95 R47.2 JP11.1 JP11.2 | 41.81,34.29 41.81,31.98 42.65,31.14 42.65,29.06 42.37,28.78 U11.3
N$43
  Top 0.254: U17.6 33.99,50.78 34.42,51.21 34.42,52.88 34.77,53.24 39.24,53.24 39.52,52.96 39.52,51.33 R35.2
  Top 0.406: C10.A R35.2 R34.1
N$50
  Top 0.406: R28.2 54.69,70.42 LED4.A
N$52
  Top 0.406: JP10.1 JP10.2 R2.2
N$53  (via drill 0.6)
  Top 0.254: U17.7 28.34,49.94 28.78,49.51 33.73,49.51 33.98,49.25 33.98,45.9 v34.11,45.77 | v39.5,45.75 R37.2
  Top 0.406: R36.1 R37.2 C9.A
  Bottom 0.254: v34.11,45.77 39.47,45.77 v39.5,45.75
N$56
  Bottom 0.406: R49.1 14.99,76.96 15.24,76.71 21.08,76.71 21.59,76.2 24.58,76.2 U$3.1
N$57  (via drill 0.6)
  Top 0.254: R42.2 R44.2 | v28.93,52.17 28.57,52.17 27.84,51.41 U17.8
  Top 0.305: 25.18,42.85 24.49,42.85 23.38,43.95 U18.12 | 25.18,42.85 R45.2 24.82,42.49 C14.A 24.99,40.59 24.99,38.46 24.79,38.25 C27.1 | U18.17 25.13,47.2 v26.09,48.16 | R44.2 28.59,54.49 28.93,54.15 v28.93,52.17 | 25.18,42.85 26.24,42.85 v26.7,42.39
  Bottom 0.254: C20.A 27.58,50.8 v28.93,52.17
  Bottom 0.305: v26.7,42.39 26.7,47.55 v26.09,48.16 26.09,48.18 26.62,48.72 C20.A 26.8,50.98 26.8,53.24 26.62,53.42 C17.1
N$59  (via drill 0.6)
  Top 0.305: v35.56,74.68 35.81,74.68 36.32,74.17 42.16,74.17 42.67,74.68 45.52,74.68 U7.3 U7.2
  Bottom 0.406: U$3.4 34.2,76.04 v35.56,74.68 R50.1
N$60
  Top 0.254: U18.19 23.94,48.5 26.11,50.67 | 26.11,50.67 26.21,50.77 U17.10 | R42.1 25.22,51.56 26.11,50.67
N$67
  Top 0.254: U18.18 24.18,47.85 25.93,49.61 27.03,49.61 27.33,49.91 27.33,50.77 U17.9 27.34,52.58 R44.1
N$68
  Top 0.305: U18.13 25.14,44.6 R45.1 25.2,46.14 R46.2
N$73  (via drill 0.6)
  Top 0.305: v47.88,82.55 47.88,79.41 RX3.A
  Bottom 0.305: R30.1 47.99,82.44 v47.88,82.55
N$74
  Top 0.406: TX3.A R31.1
PIC1  (via drill 0.6)
  Top 0.254: v34.29,67.56 35.31,68.58 42.42,68.58 43.18,67.82 43.18,65.79 43.69,65.28 JP7.2
  Top 0.305: U7.1 45.64,79.65 45.06,80.24 34.49,80.24 33.25,78.99 33.25,68.61 v34.29,67.56
  Top 0.406: U7.1 45.64,78.95 RX3.C
  Bottom 0.254: U8.7 33.91,67.18 v34.29,67.56
PIC2  (via drill 0.6)
  Top 0.254: v34.29,69.34 44.45,69.34 JP7.3
  Top 0.305: U7.4 45.64,71.87 TX3.C 45.36,71.68 44.48,70.79 44.48,69.37 44.45,69.34
  Bottom 0.254: U8.6 33.66,68.45 v34.29,69.34
SCL
  Top 0.254: U18.2 6.48,48.5 JP3.1
SDA
  Top 0.254: U18.3 10.52,47.85 8.89,46.23 JP3.2
TSAL_EN  (via drill 0.6)
  Top 0.406: v2.41,54.36 2.41,38.35 3.94,36.83 3.94,34.54 4.7,33.78 11.18,33.78 12.19,32.77 12.19,31.99 U$11.4
  Bottom 0.406: JP17.2 3.17,55.12 v2.41,54.36
V+  (via drill 0.6)
  Top 0.406: 45.8,89.41 C26.+ | U7.8 50.88,79.12 v51.03,79.27 | R31.2 52.55,71.68 53.03,72.16 53.03,74.42 53.85,75.23 54.68,75.23 R28.1 54.69,77.9 V+.1 | v34.04,82.3 42.11,82.3 v42.88,83.06
  Top 0.61: 45.8,89.41 JP12.1
  Bottom 0.305: R30.2 42.9,80.52 42.88,80.49
  Bottom 0.406: R51.2 U13.6 37.47,65.91 U8.8 | R50.2 R51.2 | R51.2 38.59,71.14 38.61,71.12 38.12,71.12 R51.2 | V+.1 53.31,79.27 v51.03,79.27 50.83,79.07 C25.1 | U3.8 33.66,82.68 v34.04,82.3
  Bottom 0.61: 42.88,76.66 50.79,76.66 C25.1 | 39.6,66.62 38.18,66.62 U13.6
  Bottom 1.422: JP12.1 43.99,89.41 42.88,88.29 42.88,83.82 v42.88,83.06 42.88,80.49 42.88,76.66 42.88,69.06 41.12,67.31 38.86,67.31 U13.6
V-  (via drill 0.6)
  Top 0.254: 21.06,46.56 21.01,46.56 20.8,46.76 20.8,49.02 20.93,49.15 U18.20 21.68,50.56 v21.87,50.75 | U18.16 21.06,46.56 | 21.06,46.56 20.8,46.3 20.8,45.47 21.01,45.26 | 21.01,45.26 21.67,45.26 U18.14 | U18.11 20.98,43.3 20.83,43.46 20.83,45.09 21.01,45.26 | U11.8 33.56,27.47 33.17,27.86 33.17,28.74 R40.1 | U10.8 33.23,35.09 33.14,35
  Top 0.305: R46.1 23.38,46.44 23.27,46.56 U18.16 | C27.2 21.95,38.25 21.84,38.35 21.84,40.59 C14.C | U17.3 27.84,47.37 27.71,47.5 | U17.1 26.82,46.57 26.82,47.37 26.95,47.5 27.71,47.5 | 27.71,47.5 27.89,47.68 27.89,48.36 v27.96,48.44 | v23.14,42.62 22.2,42.62 22.02,42.8 | 33.05,40.34 29.01,40.34 v27.96,41.38
  Top 0.406: C14.C 22.02,42.8 22.02,42.96 U18.11 | R35.1 C10.C R37.1 C9.C 33.86,41.15 33.05,40.34 33.05,36.49 R48.1 33.14,35 33.14,29.11 R40.1 33.02,28.97 33.02,30.99 31.52,32.49 JP4.1 | R7.1 22.86,25.15 22.86,25.4
  Top 0.61: JP4.1 JP4.2 | 33.16,28.83 R40.1
  Top 1.676: 22.86,25.4 22.86,32.36 JP4.1
  Bottom 0.254: v21.87,50.75 24.18,50.75 C20.C
  Bottom 0.305: C17.2 23.62,53.42 23.52,53.31 23.52,51.1 C20.C | v27.96,48.44 v27.96,41.38 27.58,41 23.32,41 23.16,41.15 23.16,42.6 v23.14,42.62
  Bottom 0.61: 24.51,25.15 26.16,26.8 36.07,26.8 39.24,23.62 39.24,21.46 40.13,20.57 C4.2
  other vias: 17.53,25.15 27.18,1.27 26.16,25.15 23.11,21.84 22.35,15.62 14.73,17.02
  pour Top: 9.14,0.76 9.14,24.28 arc-90 10.77,25.91 27.94,25.91 27.94,0.76
  pour Bottom: 9.14,0.76 9.14,24.2 arc-90 10.85,25.91 27.94,25.91 27.94,0.76

### Text on the board
tPlace: GLV | HV
_tsilk: U13 | C3 | C26 | RX3 | V+ | U7 | R28 | LED4 | TX3 | R31 | GN | GLV | HV | R42 | R44 | R35 | R1 | U18 | R34 | R46 | U17 | C10 | R37 | R36 | R45 | C15 | C14 | R2 | C9 | C27 | U10 | C16 | R47 | R48 | 1 | U11 | R41 | R40 | 1 | R7 | U2 | R13 | R6 | IC1 | C7 | R12 | C4 | R11 | R10 | R4 | D1 | U6 | R3 | R8 | R9 | C5 | Q1 | R15
_bsilk: R25 | R33 | U3 | R49 | R30 | C25 | C1 | R51 | U1 | R50 | U8 | C2 | C17 | C20 | R5 | C6